# EAGLE design FunctionalGeneratorPCBGhebeh (EAGLE 9.6.2)
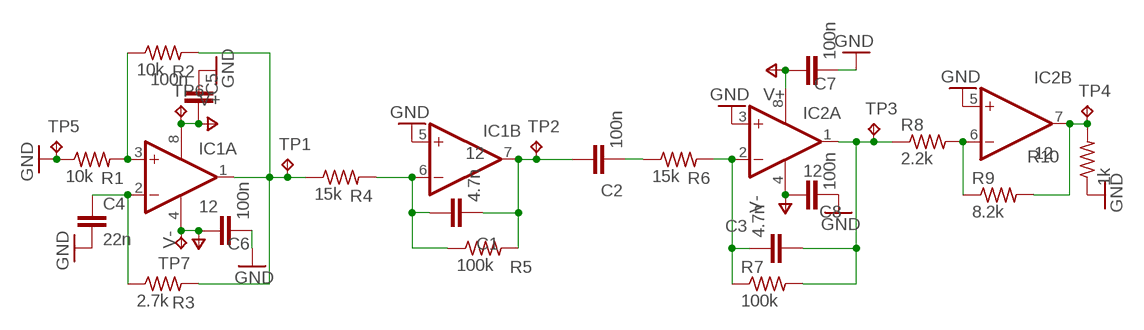
[diagram p0: schematic, sheet 1]

## Parts
C1  4.7n  C5/3  [C5B3]
C2  100n  C5/3  [C5B3]
C3  4.7n  C5/3  [C5B3]
C4  22n  C5/3  [C5B3]
C5  100n  C5/3  [C5B3]
C6  100n  C5/3  [C5B3]
C7  100n  C5/3  [C5B3]
C8  100n  C5/3  [C5B3]
IC1  12  OPA2P  [DIL08]
IC2  12  OPA2P  [DIL08]
R1  10k  R-US_0309/10  [0309/10]
R2  10k  R-US_0309/10  [0309/10]
R3  2.7k  R-US_0309/10  [0309/10]
R4  15k  R-US_0309/10  [0309/10]
R5  100k  R-US_0309/10  [0309/10]
R6  15k  R-US_0309/10  [0309/10]
R7  100k  R-US_0309/10  [0309/10]
R8  2.2k  R-US_0309/10  [0309/10]
R9  8.2k  R-US_0309/10  [0309/10]
R10  1k  R-US_0309/10  [0309/10]
TP1  TPPAD1-13Y  [P1-13Y]
TP2  TPPAD1-13Y  [P1-13Y]
TP3  TPPAD1-13Y  [P1-13Y]
TP4  TPPAD1-13Y  [P1-13Y]
TP5  TPPAD1-13Y  [P1-13Y]
TP6  TPPAD1-13Y  [P1-13Y]
TP7  TPPAD1-13Y  [P1-13Y]

## Nets
GND: C4.2 C5.2 C6.2 C7.2 C8.1 IC1.5(B:+IN) IC2.3(A:+IN) IC2.5(B:+IN) R1.1 R10.1 TP5.TP
N$1: IC1.3(A:+IN) R1.2 R2.1
N$2: C4.1 IC1.2(A:-IN) R3.1
N$3: IC1.1(A:OUT) R2.2 R3.2 R4.1 TP1.TP
N$4: C1.1 IC1.6(B:-IN) R4.2 R5.1
N$5: C1.2 C2.1 IC1.7(B:OUT) R5.2 TP2.TP
N$6: C3.1 IC2.2(A:-IN) R6.2 R7.1
N$7: C2.2 R6.1
N$8: C3.2 IC2.1(A:OUT) R7.2 R8.1 TP3.TP
N$9: IC2.6(B:-IN) R8.2 R9.1
N$10: IC2.7(B:OUT) R9.2 R10.2 TP4.TP
V+: C5.1 C7.1 IC1.8(A:V+) IC2.8(A:V+) TP6.TP
V-: C6.1 C8.2 IC1.4(A:V-) IC2.4(A:V-) TP7.TP

## Library data of the parts
C1-C8 = ECE2240+Project:C: CAPACITOR naming: grid - package width
IC1 IC2 = ECE2240+Project:OPA2*: Dual Operational Amplifier Low Power, Single-Supply, Rail-To-Rail Operational Amplifier Source: http://focus.ti.com/lit/ds/symlink/opa2345.pdf http://focus.ti.com .. opa241.pdf http://focus.ti.com/lit/ds/symlink/opa2134.pdf
R1-R10 = ECE2240+Project:R-US_: RESISTOR, American symbol
TP1-TP7 = testpad:TP: Test pad

## Board
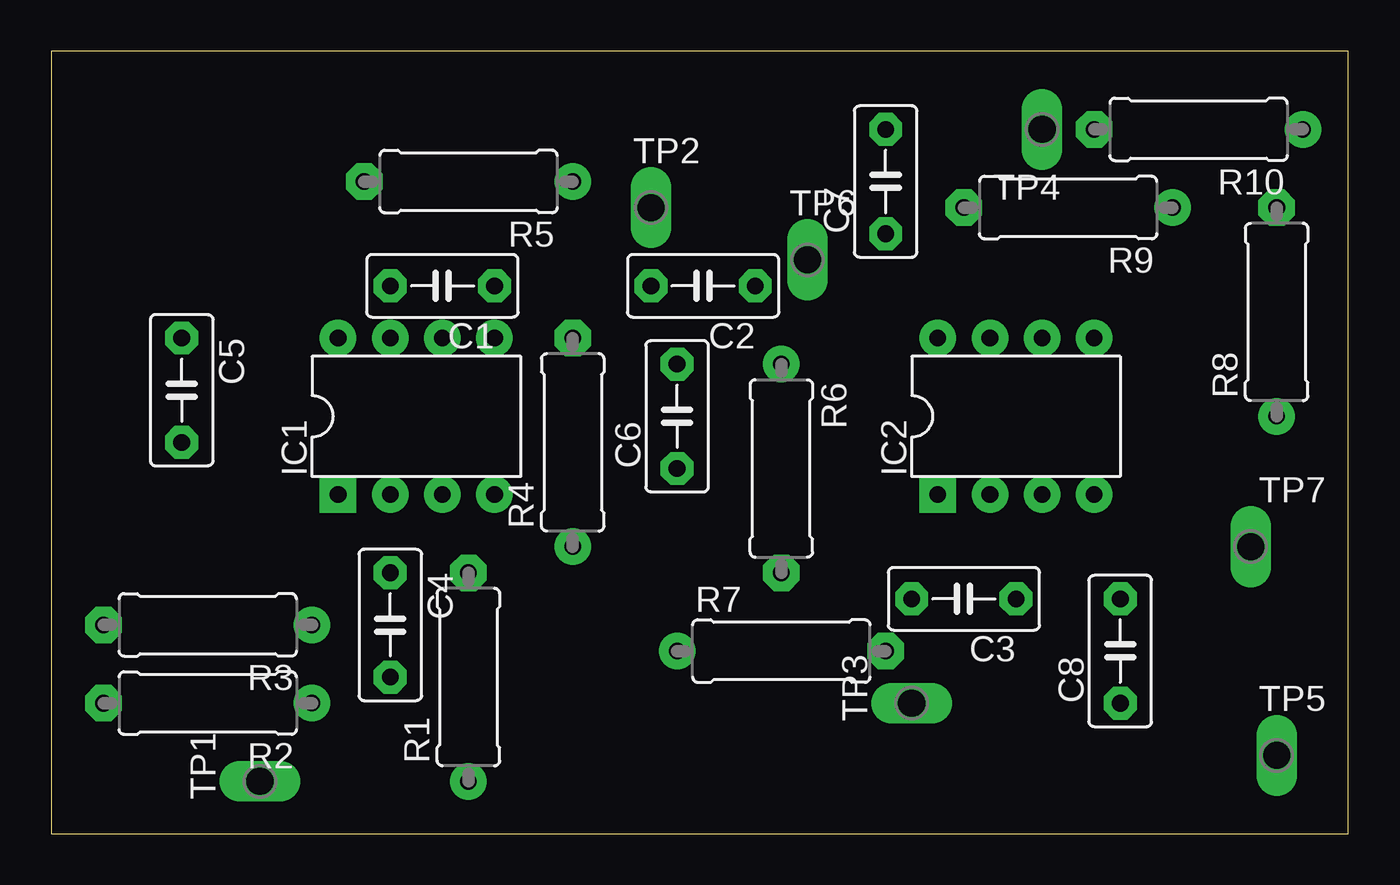
[diagram p1: board, top side]
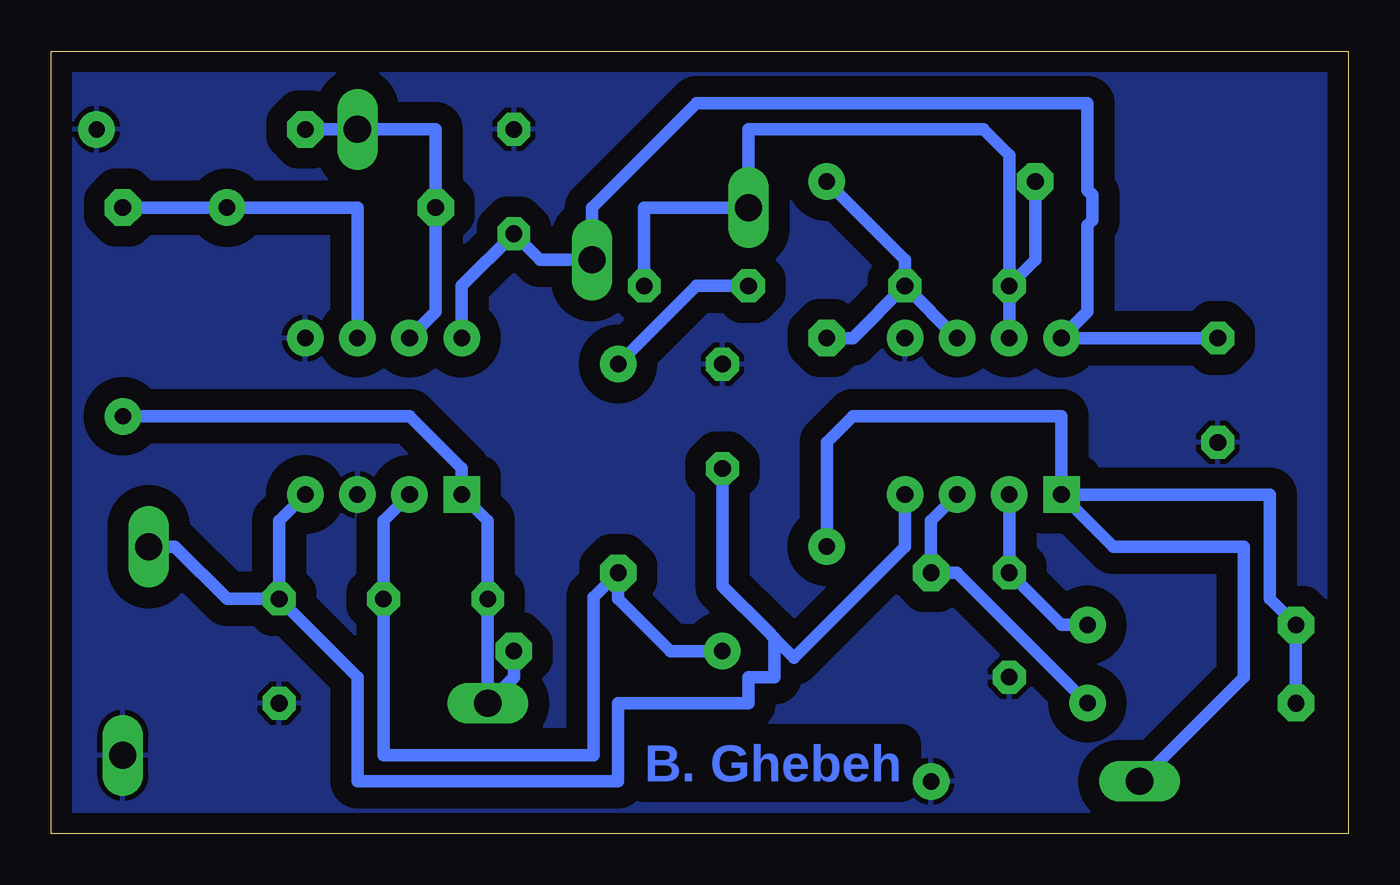
[diagram p2: board, bottom side, seen from below]

Size 63.17 x 38.09 mm. Coordinates in mm from the lower left corner, seen from the top.
Outline: 0,0 63.17,0 63.17,38.09 0,38.09 0,0
Copper layers (1*16): Top 0.035mm / dielectric 1.5mm / Bottom 0.035mm
Design rules "default *": minimum track width 6mil, minimum drill 0.35mm, track to track 12mil, track to pad 12mil, pad to pad 12mil, via to via 12mil, smd to smd 12mil, copper to edge 40mil, drill to drill 6mil, minimum pad ring 10mil, minimum via ring 8mil, stop-mask expansion 4mil, vias tented up to drill 0mil, thermal gap 10mil

### Footprints (pad centres in the part's own frame; a part is rotated, then mirrored left to right if it is on the bottom)
C5B3 = drill 0.813 pad 1.6 octagon: 1 -2.54,0; 2 2.54,0
DIL08 = drill 0.813 pad 1.778 square: 1 -3.81,-3.81 | drill 0.813 pad 1.778: 2 -1.27,-3.81; 3 1.27,-3.81; 4 3.81,-3.81; 5 3.81,3.81; 6 1.27,3.81; 7 -1.27,3.81; 8 -3.81,3.81
0309/10 = drill 0.8 pad 1.778: 1 -5.08,0 | drill 0.813 pad 1.778 octagon: 2 5.08,0
P1-13Y = drill 1.321 pad 1.905 long: TP 0,0

### Placement (x,y rotation side)
C1  19.05,26.67 180 top
C2  31.75,26.67 180 top
C3  44.45,11.43 180 top
C4  16.51,10.16 270 top
C5  6.35,21.59 270 top
C6  30.48,20.32 90 top
C7  40.64,31.75 90 top
C8  52.07,8.89 90 top
IC1  17.78,20.32 0 top
IC2  46.99,20.32 0 top
R1  20.32,7.62 90 top
R2  7.62,6.35 180 top
R3  7.62,10.16 180 top
R4  25.4,19.05 90 top
R5  20.32,31.75 180 top
R6  35.56,17.78 270 top
R7  35.56,8.89 0 top
R8  59.69,25.4 90 top
R9  49.53,30.48 180 top
R10  55.88,34.29 180 top
TP1  10.16,2.54 90 top
TP2  29.21,30.48 0 top
TP3  41.91,6.35 90 top
TP4  48.26,34.29 180 top
TP5  59.69,3.81 0 top
TP6  36.83,27.94 0 top
TP7  58.42,13.97 0 top

### Tracks (layer width: path | path; a pad name or v marks a point on that pad's centre or on a via)
GND
  pour Bottom (isolate 1.016): 0,38.1 0,0 63.5,0 63.5,38.1
N$1
  Bottom 0.61: IC1.3 20.32,15.24 R1.2 19.05,12.7 R2.1
N$2
  Bottom 0.61: R3.1 13.97,10.16 C4.1 IC1.2
N$3
  Bottom 0.61: R2.2 R3.2 3.81,11.43 3.81,16.51 IC1.1 | IC1.1 11.43,13.97 5.08,13.97 5.08,7.62 TP1.TP | R4.1 25.4,19.05 24.13,20.32 13.97,20.32 IC1.1
N$4
  Bottom 0.61: C1.1 IC1.6 | R4.2 24.13,24.13 C1.1 | R5.1 21.59,27.94 C1.1
N$5
  Bottom 0.61: C1.2 IC1.7 | C1.2 15.24,27.94 R5.2 | C2.1 34.29,30.48 TP2.TP 29.21,34.29 17.78,34.29 16.51,33.02 C1.2
N$6
  Bottom 0.61: IC2.2 46.99,15.24 C3.1 46.99,3.81 36.75,3.81 36.75,11.51 R6.2 35.56,11.43 33.02,8.89 R7.1
N$7
  Bottom 0.61: R6.1 31.75,26.67 C2.2
N$8
  Bottom 0.61: R7.2 40.64,7.62 TP3.TP C3.2 41.91,15.24 IC2.1 43.18,17.78 45.72,20.32 R8.1
N$9
  Bottom 0.61: R8.2 R9.1 48.26,30.48 IC2.6
N$10
  Bottom 0.61: IC2.7 44.45,25.4 R9.2 44.45,34.29 TP4.TP R10.2
V+
  Bottom 0.61: IC2.8 43.18,26.67 C7.1 39.37,27.94 TP6.TP 36.83,30.48 31.75,35.56 12.7,35.56 12.7,31.33 12.47,31.1 12.47,29.86 12.7,29.63 12.7,25.4 IC1.8 12.7,24.13 12.28,24.13 C5.1
V-
  Bottom 0.61: C6.1 30.47,17.77 30.47,12.05 28.26,9.84 27.94,9.52 | 27.94,9.52 26.99,8.57 21.59,13.97 IC1.4 | C8.2 48.26,7.62 48.26,2.54 35.56,2.54 35.56,6.35 29.21,6.35 29.21,7.62 27.94,7.62 27.94,9.52 | TP7.TP 57.15,13.97 54.61,11.43 C8.2 | C8.2 52.07,15.24 IC2.4

### Text on the board
Bottom: B. Ghebeh